# Altium schematic sheet power_supply.SchDoc: SCOPE-F07x: power_supply
size A4; Organization: Draw By: OldGerman; Address2: https://github.com; Address3: /oldgerman/SCOPE-F07x; Revision: v1.1; SheetNumber: 4; SheetTotal: 5
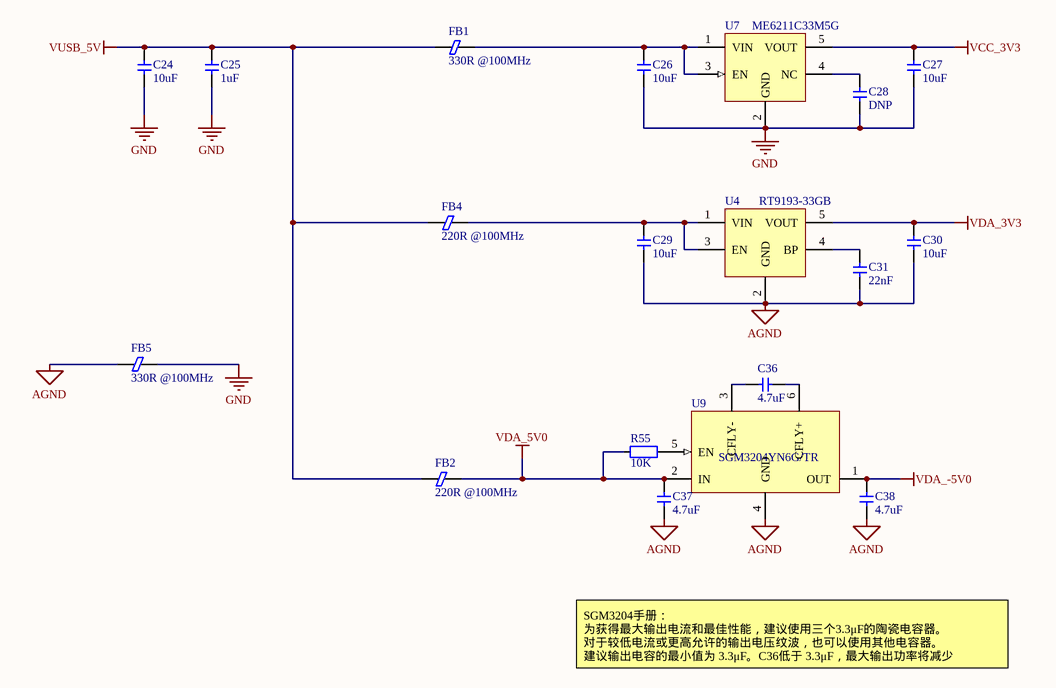
[diagram p0: power_supply.SchDoc]

## Parts
C24  10uF  [C0402]
C25  1uF  [C0402]
C26  10uF  [C0402]
C27  10uF  [C0402]
C28  DNP  [C0402]
C29  10uF  [C0402]
C30  10uF  [C0402]
C31  22nF  [C0402]
C36  4.7uF  [C0402]
C37  4.7uF  [C0402]
C38  4.7uF  [C0402]
FB1  330R @100MHz  [FER0603]
FB2  220R @100MHz  [FER0402]
FB4  220R @100MHz  [FER0402]
FB5  330R @100MHz  [FER0603]
R55  10K  [R0402]
U4  RT9193-33GB  [MICROCHIP SOT-23-5 OT]
U7  ME6211C33M5G  [ANALOG TSOT-23-5 UJ-5]
U9  SGM3204YN6G/TR  [MICROCHIP SOT-23-6 M6]

## Nets
AGND: C29.2 C30.2 C31.2 C37.2 C38.2 FB5.2 U4.2(GND) U9.4(GND)
GND: C24.2 C25.2 C26.2 C27.2 C28.2 FB5.1 U7.2(GND)
VCC_3V3: C27.1 U7.5(VOUT)
VDA_3V3: C30.1 U4.5(VOUT)
VDA_5V0: C37.1 FB2.1 R55.2 U9.2(IN)
VDA_-5V0: C38.1 U9.1(OUT)
VUSB_5V: C24.1 C25.1 FB1.1 FB2.2 FB4.1
NetC26_1: C26.1 FB1.2 U7.1(VIN) U7.3(EN)
NetC28_1: C28.1 U7.4(NC)
NetC29_1: C29.1 FB4.2 U4.1(VIN) U4.3(EN)
NetC31_1: C31.1 U4.4(BP)
NetC36_1: C36.1 U9.3(CFLY-)
NetC36_2: C36.2 U9.6(CFLY+)
NetR55_1: R55.1 U9.5(EN)

## Notes on the sheet
- SGM3204手册：
  为获得最大输出电流和最佳性能，建议使用三个3.3μF的陶瓷电容器。
  对于较低电流或更高允许的输出电压纹波，也可以使用其他电容器。
  建议输出电容的最小值为 3.3μF。C36低于 3.3μF，最大输出功率将减少
- Title
- Size:
- Date:
- A4
- Number:
- Time:
- Revision:
- Sheet
- of
- File:

## Library data of the parts
C24-C31 C36-C38 = CAP: Capacitor; Value: 0.1u
FB1 FB2 FB4 FB5 = Ferrite: 磁珠
R55 = RES: Resistor; Value: 22R
U4 = LP2992: LDO
U7 = ME6211C33M5G: 线性稳压芯片; BOM名称: 可调升压芯片; 版权归属: 源创客; 学习资源: www.ooocke.com
U9 = SGM3204YN6G/TR: Unregulated 200mA / Charge Pump Voltage Inverter / 1.4-5.5V to -1.4-5.5V; BOM名称: 可调升压芯片; 版权归属: 源创客; 学习资源: www.ooocke.com